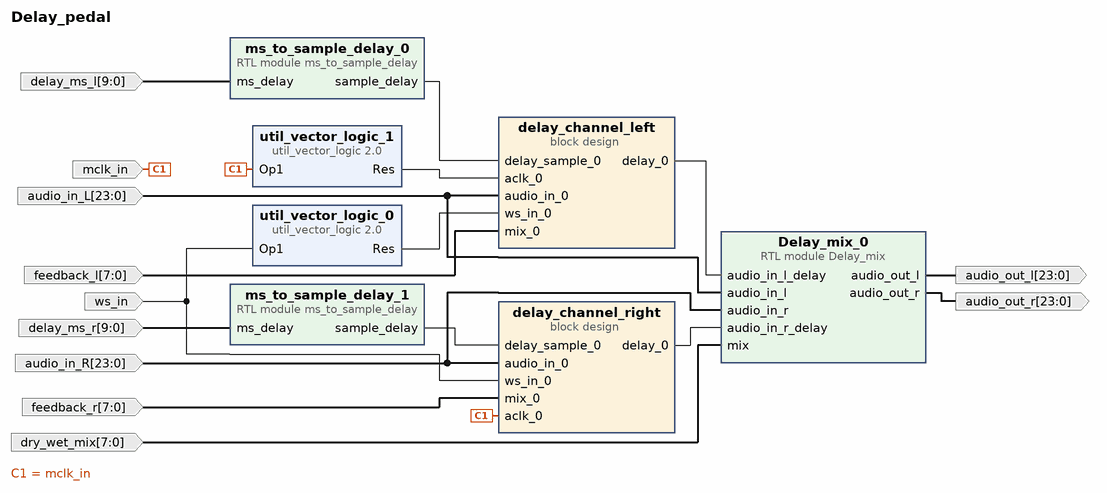
[diagram p0: block diagram of the top level]
# Vivado block design Delay_pedal, xc7a100tcsg324-1, Vivado 2022.1
create_bd_design Delay_pedal

create_bd_port -dir I -type clk mclk_in
set_property -dict {CONFIG.FREQ_HZ 11289000} [get_bd_ports mclk_in]
create_bd_port -dir I -type clk ws_in
set_property -dict {CONFIG.FREQ_HZ 44000} [get_bd_ports ws_in]
create_bd_port -dir I -from 23 -to 0 audio_in_L
create_bd_port -dir I -from 23 -to 0 audio_in_R
create_bd_port -dir O -from 23 -to 0 audio_out_l
create_bd_port -dir O -from 23 -to 0 audio_out_r
create_bd_port -dir I -from 7 -to 0 feedback_r
create_bd_port -dir I -from 7 -to 0 feedback_l
create_bd_port -dir I -from 9 -to 0 delay_ms_l
create_bd_port -dir I -from 9 -to 0 delay_ms_r
create_bd_port -dir I -from 7 -to 0 dry_wet_mix

create_bd_cell -type ip -vlnv xilinx.com:ip:util_vector_logic:2.0 util_vector_logic_1
set_property -dict {CONFIG.C_OPERATION not CONFIG.C_SIZE 1} [get_bd_cells util_vector_logic_1]
create_bd_cell -type container -reference delay_channel_1 delay_channel_right
set_property -dict [list \
  CONFIG.ACTIVE_SIM_BD delay_channel_1.bd \
  CONFIG.ACTIVE_SYNTH_BD delay_channel_1.bd \
  CONFIG.ENABLE_DFX 0 \
  CONFIG.LIST_SIM_BD delay_channel_1.bd \
  CONFIG.LIST_SYNTH_BD delay_channel_1.bd \
  CONFIG.LOCK_PROPAGATE 0 \
] [get_bd_cells delay_channel_right]
create_bd_cell -type module -reference Delay_mix Delay_mix_0
create_bd_cell -type ip -vlnv xilinx.com:ip:util_vector_logic:2.0 util_vector_logic_0
set_property -dict {CONFIG.C_OPERATION not CONFIG.C_SIZE 1} [get_bd_cells util_vector_logic_0]
create_bd_cell -type container -reference delay_channel_1 delay_channel_left
set_property -dict [list \
  CONFIG.ACTIVE_SIM_BD delay_channel_1.bd \
  CONFIG.ACTIVE_SYNTH_BD delay_channel_1.bd \
  CONFIG.ENABLE_DFX 0 \
  CONFIG.LIST_SIM_BD delay_channel_1.bd \
  CONFIG.LIST_SYNTH_BD delay_channel_1.bd \
  CONFIG.LOCK_PROPAGATE 0 \
] [get_bd_cells delay_channel_left]
create_bd_cell -type module -reference ms_to_sample_delay ms_to_sample_delay_0
create_bd_cell -type module -reference ms_to_sample_delay ms_to_sample_delay_1

# ---- connections ----

connect_bd_net [get_bd_pins Delay_mix_0/audio_out_l] [get_bd_ports audio_out_l]
connect_bd_net [get_bd_pins Delay_mix_0/audio_out_r] [get_bd_ports audio_out_r]
connect_bd_net -net audio_in_0_0_1 [get_bd_ports audio_in_R] [get_bd_pins delay_channel_right/audio_in_0] [get_bd_pins Delay_mix_0/audio_in_r]
connect_bd_net [get_bd_ports audio_in_L] [get_bd_pins Delay_mix_0/audio_in_l] [get_bd_pins delay_channel_left/audio_in_0]
connect_bd_net -net delay_channel_1_1_delay_0 [get_bd_pins delay_channel_right/delay_0] [get_bd_pins Delay_mix_0/audio_in_r_delay]
connect_bd_net [get_bd_pins delay_channel_left/delay_0] [get_bd_pins Delay_mix_0/audio_in_l_delay]
connect_bd_net [get_bd_ports mclk_in] [get_bd_pins util_vector_logic_1/Op1] [get_bd_pins delay_channel_right/aclk_0]
connect_bd_net -net mix_0_0_1 [get_bd_ports feedback_r] [get_bd_pins delay_channel_right/mix_0]
connect_bd_net -net mix_0_0_2 [get_bd_ports feedback_l] [get_bd_pins delay_channel_left/mix_0]
connect_bd_net -net mix_0_1 [get_bd_ports dry_wet_mix] [get_bd_pins Delay_mix_0/mix]
connect_bd_net -net ms_delay_0_1 [get_bd_ports delay_ms_l] [get_bd_pins ms_to_sample_delay_0/ms_delay]
connect_bd_net -net ms_delay_0_2 [get_bd_ports delay_ms_r] [get_bd_pins ms_to_sample_delay_1/ms_delay]
connect_bd_net [get_bd_pins ms_to_sample_delay_0/sample_delay] [get_bd_pins delay_channel_left/delay_sample_0]
connect_bd_net [get_bd_pins ms_to_sample_delay_1/sample_delay] [get_bd_pins delay_channel_right/delay_sample_0]
connect_bd_net [get_bd_pins util_vector_logic_0/Res] [get_bd_pins delay_channel_left/ws_in_0]
connect_bd_net [get_bd_pins util_vector_logic_1/Res] [get_bd_pins delay_channel_left/aclk_0]
connect_bd_net [get_bd_ports ws_in] [get_bd_pins delay_channel_right/ws_in_0] [get_bd_pins util_vector_logic_0/Op1]

validate_bd_design
save_bd_design
